# Altium schematic sheet SOP8 flash转接板.SchDoc
size A4
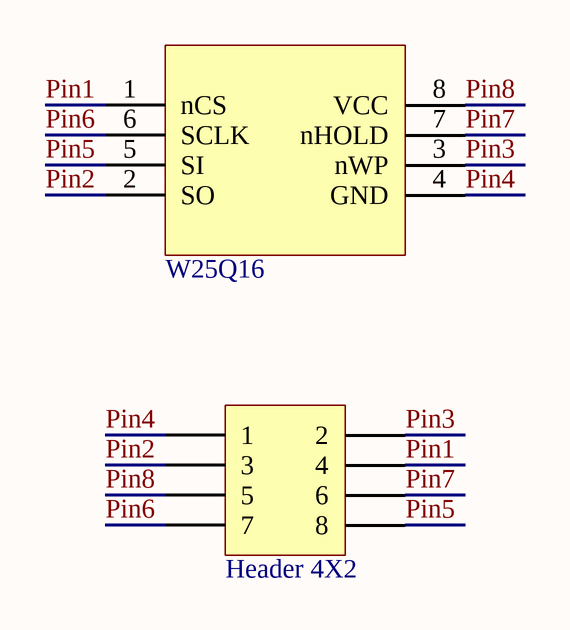
[diagram p0: SOP8 flash转接板.SchDoc]

## Parts
P1  Header 4X2  [CN_4X2P_1.27MM]
U1  W25Q16  [SOIC8-50X204]

## Nets
Pin1: P1.4 U1.1(nCS)
Pin2: P1.3 U1.2(SO)
Pin3: P1.2 U1.3(nWP)
Pin4: P1.1 U1.4(GND)
Pin5: P1.8 U1.5(SI)
Pin6: P1.7 U1.6(SCLK)
Pin7: P1.6 U1.7(nHOLD)
Pin8: P1.5 U1.8(VCC)

## Library data of the parts
P1 = Header 4X2: Header, 4-Pin, Dual row; LatestRevisionDate: 17-Jul-2002; LatestRevisionNote: Re-released for DXP Platform.; Publisher: Altium Limited
U1 = MX25Lxx